# EAGLE design Shield_Display (EAGLE 9.0.0)
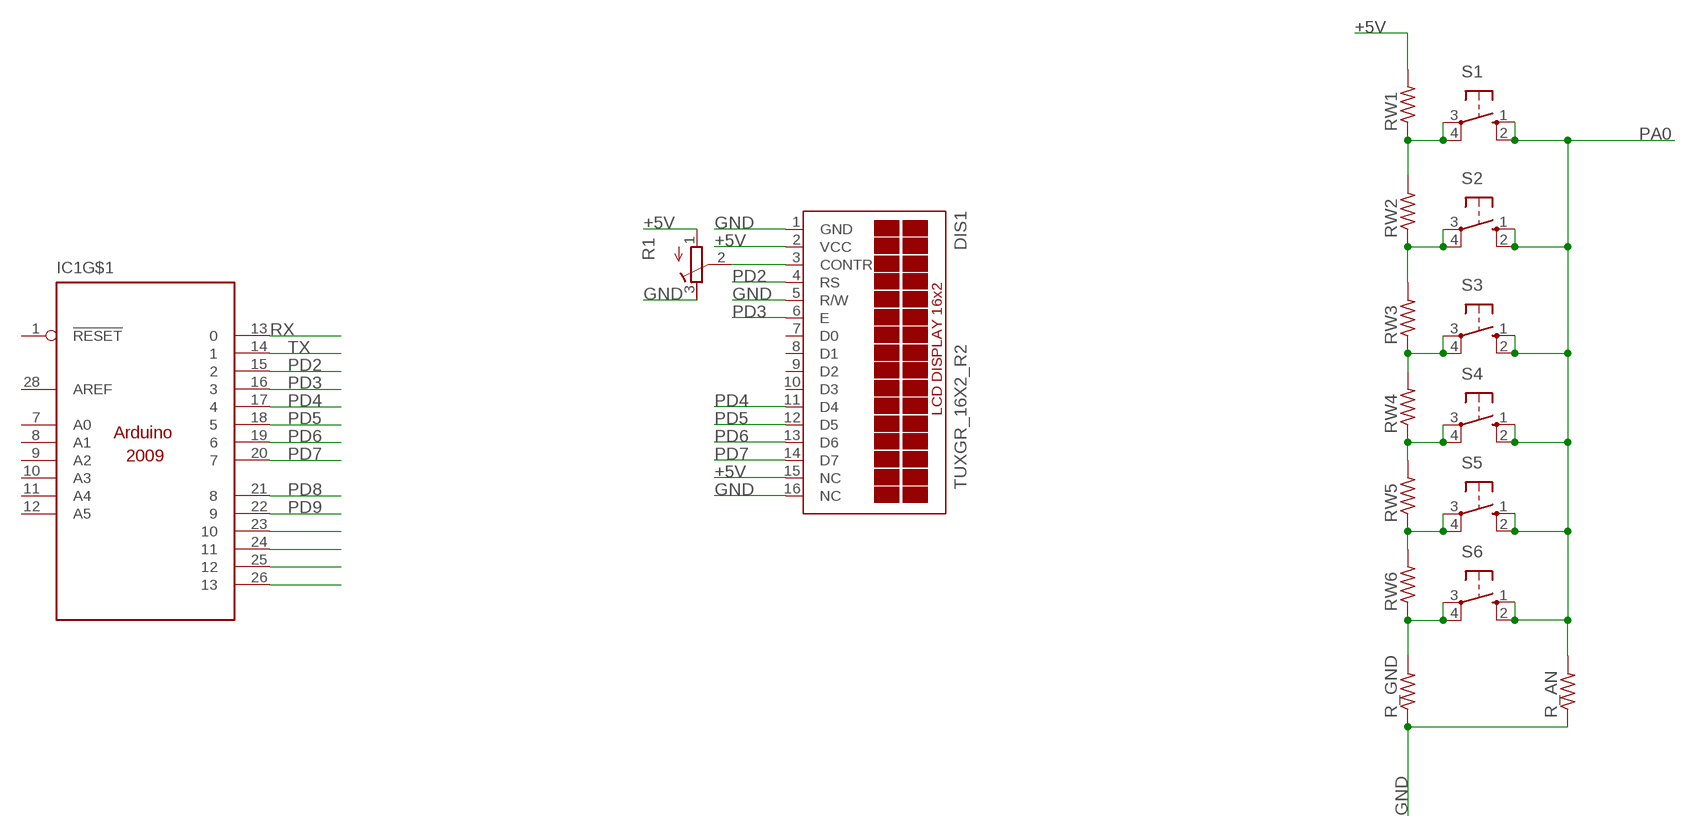
[diagram p0: schematic, sheet 1]

## Parts
DIS1  TUXGR_16X2_R2  [TUXGR_16X2_R2]
IC1  ARDUINO2009_22  [ARDUINO2009_2]
R1  R-TRIMM64W  [RTRIM64W]
R_AN  R-US_0204/7  [0204/7]
R_GND  R-US_0204/7  [0204/7]
RW1  R-US_0204/7  [0204/7]
RW2  R-US_0204/7  [0204/7]
RW3  R-US_0204/7  [0204/7]
RW4  R-US_0204/7  [0204/7]
RW5  R-US_0204/7  [0204/7]
RW6  R-US_0204/7  [0204/7]
S1  10-XX  [B3F-10XX]
S2  10-XX  [B3F-10XX]
S3  10-XX  [B3F-10XX]
S4  10-XX  [B3F-10XX]
S5  10-XX  [B3F-10XX]
S6  10-XX  [B3F-10XX]

## Nets
+5V: DIS1.2(VCC) DIS1.15(NC) R1.1(A) RW1.2
GND: DIS1.1(GND) DIS1.5(R/W) DIS1.16(NC) R1.3(E) R_AN.1 R_GND.1
N$1: IC1.26
N$2: IC1.25
N$3: IC1.24
N$4: IC1.23
N$5: DIS1.3(CONTR) R1.2(S)
N$6: RW1.1 RW2.2 S1.3(P) S1.4(P1)
N$7: RW2.1 RW3.2 S2.3(P) S2.4(P1)
N$8: RW3.1 RW4.2 S3.3(P) S3.4(P1)
N$9: RW4.1 RW5.2 S4.3(P) S4.4(P1)
N$10: RW5.1 RW6.2 S5.3(P) S5.4(P1)
N$11: R_GND.2 RW6.1 S6.3(P) S6.4(P1)
PA0: R_AN.2 S1.1(S) S1.2(S1) S2.1(S) S2.2(S1) S3.1(S) S3.2(S1) S4.1(S) S4.2(S1) S5.1(S) S5.2(S1) S6.1(S) S6.2(S1)
PD2: DIS1.4(RS) IC1.15
PD3: DIS1.6(E) IC1.16
PD4: DIS1.11(D4) IC1.17
PD5: DIS1.12(D5) IC1.18
PD6: DIS1.13(D6) IC1.19
PD7: DIS1.14(D7) IC1.20
PD8: IC1.21
PD9: IC1.22
RX: IC1.13
TX: IC1.14
Unconnected: DIS1.7(D0) DIS1.8(D1) DIS1.9(D2) DIS1.10(D3) IC1.1(!RESET) IC1.7(A0) IC1.8(A1) IC1.9(A2) IC1.10(A3) IC1.11(A4) IC1.12(A5) IC1.28(AREF)

## Power pins joined to a net without a drawn wire
+3V3: IC1.2(+3V3)
+5V: IC1.3(+5V)
+VIN: IC1.6(+VIN)
GND: IC1.4(GND) IC1.5(GND) IC1.27(GND)

## Library data of the parts
DIS1 = display-lcd:TUXGR_16X2_R2: Tuxgraphics LCD display 16x2 characters reflective, without background light Source: tuxgr_12x2_r2.pdf; OC_FARNELL: unknown; OC_NEWARK: unknown
IC1 = arduino:ARDUINO2009_2: The Arduino Duemilanove ("2009") is a microcontroller board based on the ATmega168 or ATmega328. - 14 digital input/output pins (of which 6 can be used as PWM outputs) - 6 analog inputs, a 16 MHz crystal oscillator - USB connection - power jack - ISP header - reset button It contains everything needed to support the microcontroller; simply connect it to a computer with a USB cable or power it with a AC-to-DC adapter or battery to get started http://arduino.cc/en/Main/ArduinoBoardDuemilanove
R1 = resistor:R-TRIMM: Trimm resistor
R_AN R_GND RW1-RW6 = resistor:R-US_: RESISTOR, American symbol
S1-S6 = switch-omron:10-XX: OMRON SWITCH; MPN: B3F-1000; OC_FARNELL: 176432; OC_NEWARK: 36M3542

## Board
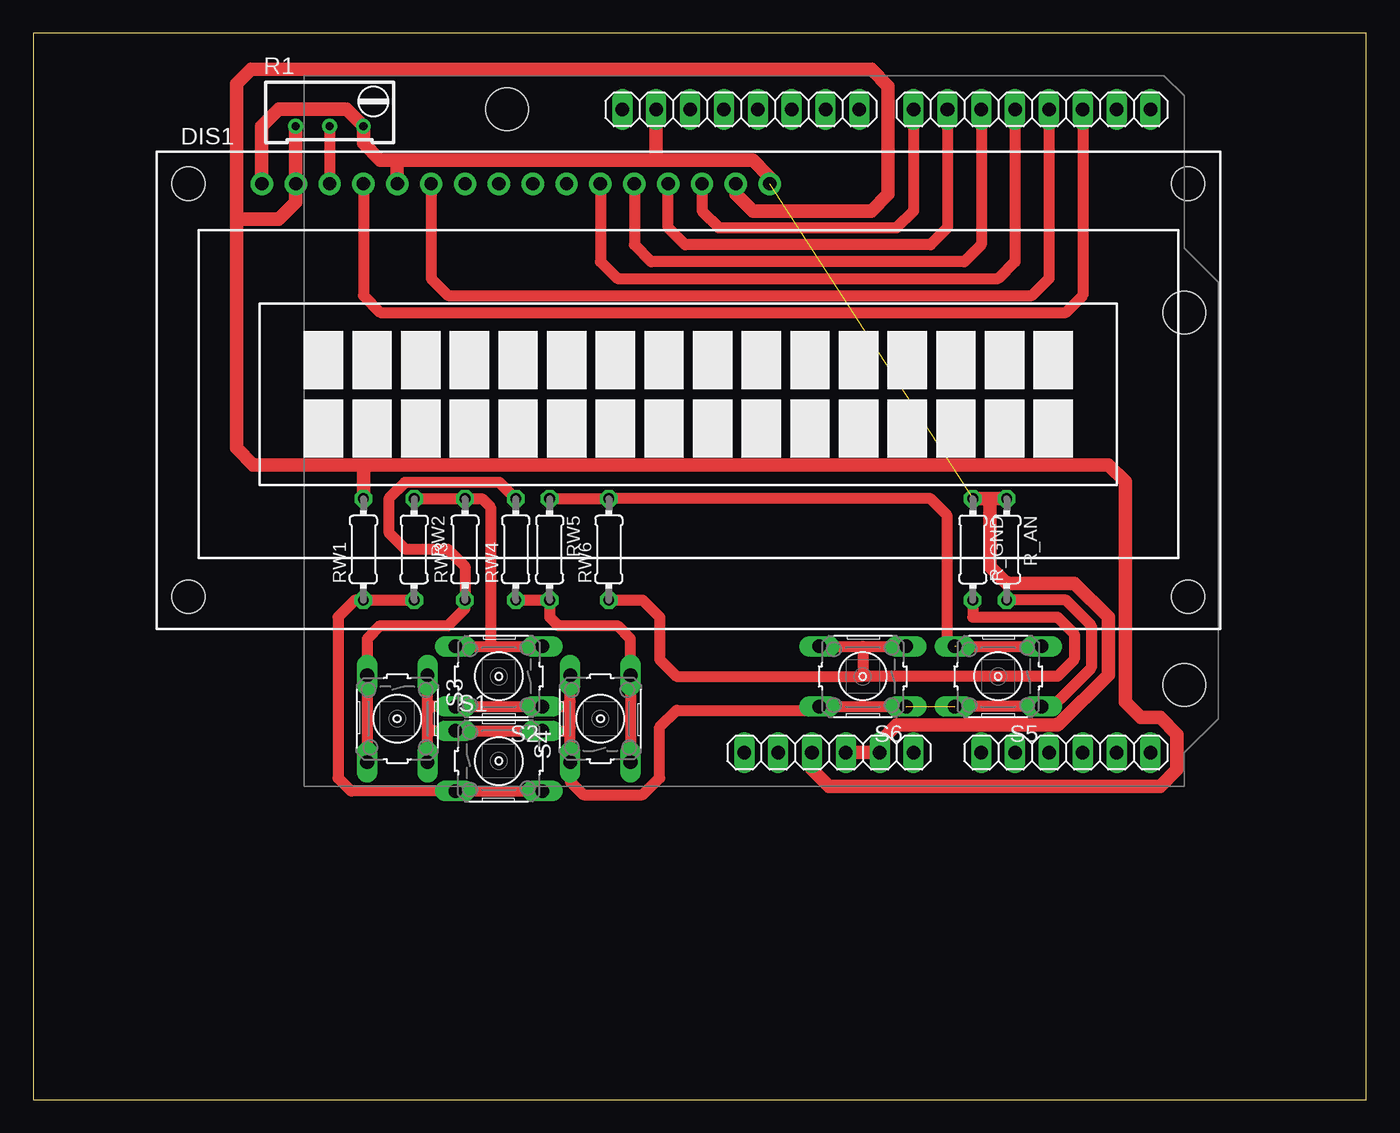
[diagram p1: board, top side]

Size 100 x 80 mm. Coordinates in mm from the lower left corner, seen from the top.
Outline: 0,0 100,0 100,80 0,80 0,0
Copper layers (1*16): Top 0.035mm / dielectric 1.5mm / Bottom 0.035mm
Design rules "default": minimum track width 6mil, minimum drill 0.35mm, track to track 6mil, track to pad 6mil, pad to pad 6mil, via to via 6mil, smd to smd 6mil, copper to edge 40mil, drill to drill 6mil, minimum pad ring 10mil, minimum via ring 8mil, stop-mask expansion 4mil, vias tented up to drill 0mil, thermal gap 10mil

### Footprints (pad centres in the part's own frame; a part is rotated, then mirrored left to right if it is on the bottom)
TUXGR_16X2_R2 = drill 1 pad 1.676: 1 -32,15.5; 2 -29.46,15.5; 3 -26.92,15.5; 4 -24.38,15.5; 5 -21.84,15.5; 6 -19.3,15.5; 7 -16.76,15.5; 8 -14.22,15.5; 9 -11.68,15.5; 10 -9.14,15.5; 11 -6.6,15.5; 12 -4.06,15.5; 13 -1.52,15.5; 14 1.02,15.5; 15 3.56,15.5; 16 6.1,15.5 | hole 2.5: -37.5,-15.5; 37.5,-15.5; -37.5,15.5; 37.5,15.5
ARDUINO2009_2 = drill 1.016 long: 1 33.02,2.54; 2 35.56,2.54; 3 38.1,2.54; 4 40.64,2.54; 5 43.18,2.54; 6 45.72,2.54; 7 50.8,2.54; 8 53.34,2.54; 9 55.88,2.54; 10 58.42,2.54; 11 60.96,2.54; 12 63.5,2.54; 13 63.5,50.8; 14 60.96,50.8; 15 58.42,50.8; 16 55.88,50.8; 17 53.34,50.8; 18 50.8,50.8; 19 48.26,50.8; 20 45.72,50.8; 21 41.656,50.8; 22 39.116,50.8; 23 36.576,50.8; 24 34.036,50.8; 25 31.496,50.8; 26 28.956,50.8; 27 26.416,50.8; 28 23.876,50.8 | hole 3.2: 15.24,50.8; 66.04,35.56; 66.04,7.62
RTRIM64W = drill 0.61: 1 1.27,-2.54; 2 1.27,0; 3 1.27,2.54
0204/7 = drill 0.813 octagon: 1 -3.81,0; 2 3.81,0
B3F-10XX = drill 1.016 long: 1 -3.251,2.261; 2 3.251,2.261; 3 -3.251,-2.261; 4 3.251,-2.261

### Placement (x,y rotation side)
DIS1  49.15,53.21 0 top
IC1  20.32,23.5 0 top
R1  22.23,74.3 270 top
R_AN  73.03,41.27 270 top
R_GND  70.48,41.27 270 top
RW1  24.77,41.27 90 top
RW2  28.57,41.27 270 top
RW3  32.38,41.27 90 top
RW4  36.2,41.27 90 top
RW5  38.73,41.27 270 top
RW6  43.18,41.27 90 top
S1  34.92,25.4 0 top
S2  34.92,31.75 180 top
S3  27.3,28.57 270 top
S4  42.55,28.57 90 top
S5  72.39,31.75 180 top
S6  62.23,31.75 180 top

### Tracks (layer width: path | path; a pad name or v marks a point on that pad's centre or on a via)
+5V
  Top 1.016: R1.1 DIS1.2 19.69,67.31 18.41,66.04 15.24,66.04 | IC1.3 58.42,24.77 59.69,23.5 84.54,23.5 85.81,24.77 85.81,27.39 84.54,28.66 83.1,28.66 81.92,29.84 81.92,46.35 80.64,47.62 24.77,47.62 | 15.24,66.04 15.24,48.9 16.51,47.62 24.77,47.62 | RW1.2 24.77,47.62 | DIS1.15 52.71,67.94 53.98,66.67 62.87,66.67 64.14,67.94 64.14,76.05 62.87,77.32 16.36,77.32 15.24,76.2 15.24,66.04
GND  (2 unrouted)
  Top 1.016: DIS1.5 27.31,70.48 | DIS1.16 55.24,69.22 53.98,70.48 46.99,70.48 | 46.99,70.48 27.31,70.48 | DIS1.1 17.15,73.03 18.41,74.3 23.5,74.3 R1.3 24.77,71.75 26.04,70.48 27.31,70.48 | IC1.27 46.74,70.74 46.99,70.48 | 73.03,38.73 78.11,38.73 80.64,36.2 80.64,31.86 76.95,28.17 76.89,28.17 76.83,28.12 64.77,28.12 63.5,26.85 IC1.5 IC1.4 | R_GND.1 71.75,45.09 | 71.75,45.09 R_AN.1 | 71.75,45.09 71.75,40.01 72.97,38.79 73.03,38.79
N$5
  Top 0.813: R1.2 DIS1.3
N$6
  Top 0.813: RW2.2 RW1.1 24.13,37.47 22.86,36.2 22.86,24.13 23.85,23.14 S1.3 S1.4
N$7
  Top 0.813: RW3.2 RW2.1 33.66,45.09 34.29,44.45 34.29,34.01 | S2.4 34.29,34.01 | 34.29,34.01 S2.3
N$8
  Top 0.813: S3.4 S3.3 25.04,34.57 26.04,35.56 31.11,35.56 32.38,36.83 RW3.1 32.38,40.01 31.11,41.27 27.94,41.27 26.67,42.55 26.67,45.09 27.89,46.3 34.98,46.3 RW4.2
N$9
  Top 0.813: S4.3 S4.4 44.81,34.57 43.81,35.56 39.37,35.56 38.73,36.2 RW5.2 RW4.1
N$10  (1 unrouted)
  Top 0.813: S5.3 69.22,34.01 68.58,34.65 68.58,43.81 67.31,45.09 RW6.2 RW5.1
N$11
  Top 0.813: 45.09,37.47 RW6.1 45.72,37.47 46.35,36.83 | S6.4 62.23,34.01 | 62.23,34.01 S6.3 | 62.23,34.01 62.23,31.75 | R_GND.2 70.48,36.2 76.83,36.2 78.11,34.92 78.11,33.02 76.83,31.75 62.23,31.75 | 62.23,31.75 48.26,31.75 46.99,33.02 46.99,36.2 46.35,36.83 | 46.35,36.83
PA0  (1 unrouted)
  Top 0.813: S5.2 S5.1 76,29.84 76.83,29.84 79.38,32.38 79.38,35.56 77.47,37.47 R_AN.2 | S6.1 S6.2 58.7,29.21 48.26,29.21 46.99,27.94 46.99,24.13 45.72,22.86 41.27,22.86 40.28,23.85 S4.1 40.28,27.94 | S3.2 29.57,27.94 | 29.57,27.94 29.57,29.21 | 29.57,29.21 S3.1 | 40.28,27.94 40.28,29.84 | 40.28,29.84 S4.2 | 29.57,29.21 29.84,29.49 S2.2 S2.1 39.93,29.49 40.28,29.84 | 29.57,27.94 29.84,27.66 S1.1 S1.2 40.01,27.66 40.28,27.94
PD2
  Top 0.813: IC1.15 78.74,60.33 77.47,59.05 26.04,59.05 24.77,60.32 DIS1.4
PD3
  Top 0.813: IC1.16 76.2,61.59 74.93,60.33 31.11,60.33 29.84,61.59 29.85,61.6 DIS1.6
PD4
  Top 0.813: DIS1.11 42.55,62.87 43.81,61.59 72.39,61.59 73.66,62.87 IC1.17
PD5
  Top 0.813: DIS1.12 45.09,64.13 46.35,62.87 69.85,62.87 71.12,64.14 IC1.18
PD6
  Top 0.813: IC1.19 68.58,65.41 67.31,64.14 48.9,64.14 47.63,65.4 DIS1.13
PD7
  Top 0.813: DIS1.14 50.17,66.67 51.44,65.41 64.77,65.41 66.04,66.67 IC1.20